# Altium schematic sheet 01 MCU.SchDoc
size A3
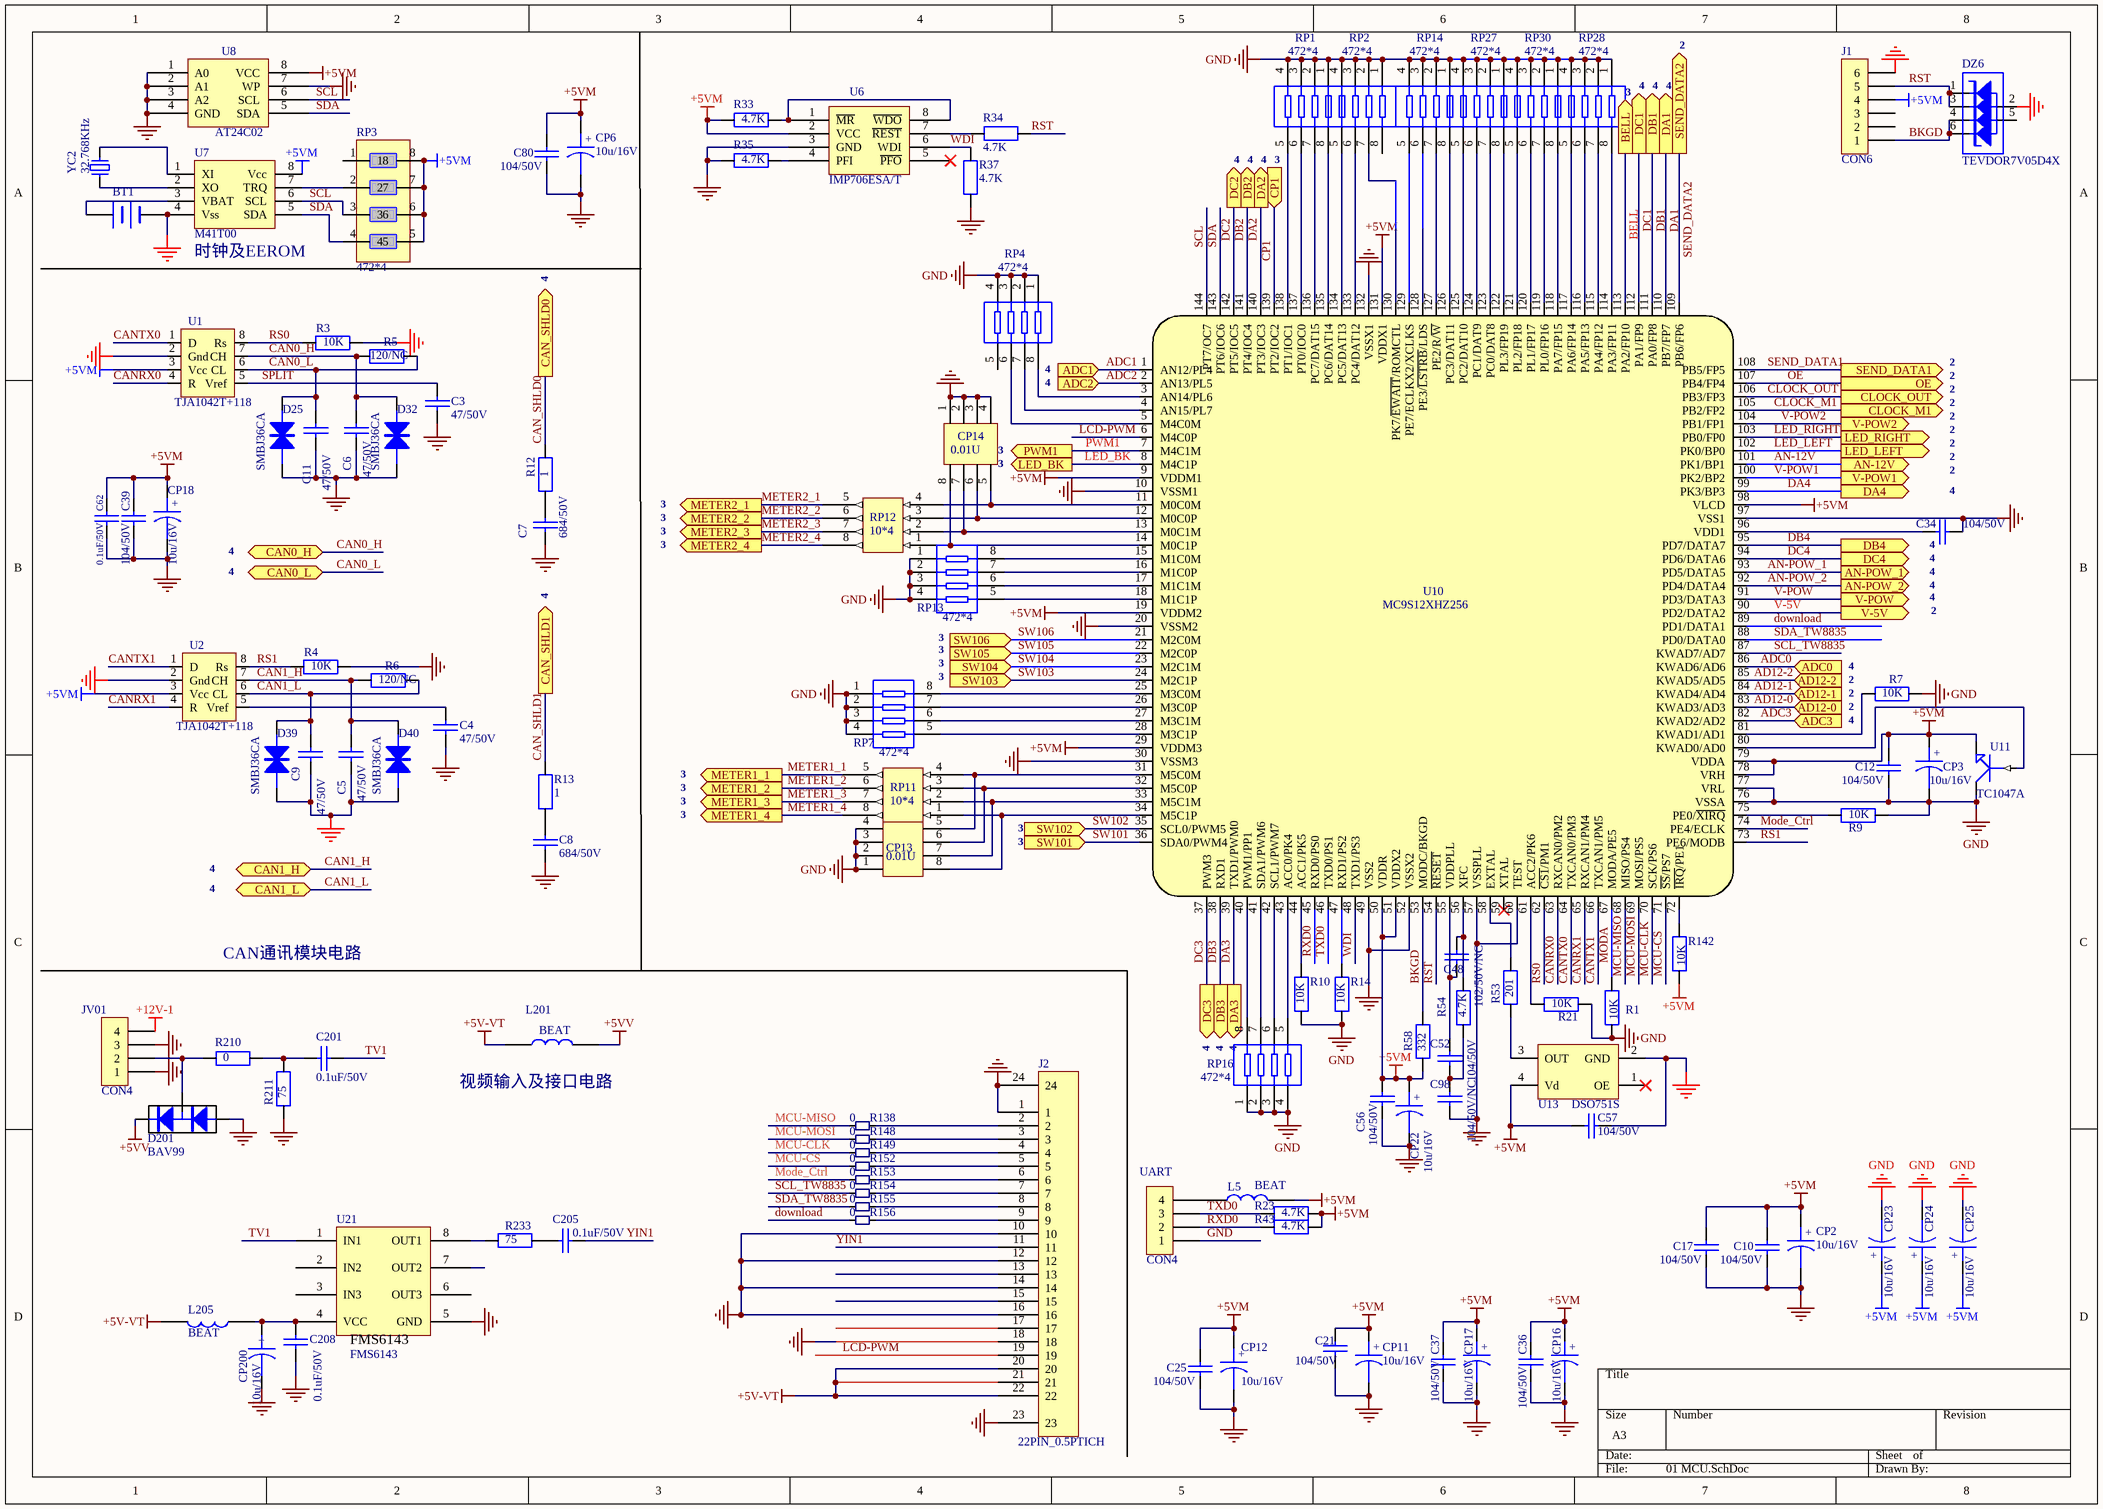
[diagram p0: 01 MCU.SchDoc]

## Parts
BT1  (no value)  [Battery 3]
C3  47/50V  [CR0805]
C4  47/50V  [CR0805]
C5  47/50V  [CR0805]
C6  47/50V  [CR0805]
C7  684/50V  [CR1206]
C8  684/50V  [CR1206]
C9  47/50V  [CR0805]
C10  104/50V  [CR0805]
C11  47/50V  [CR0805]
C12  104/50V  [CR0805]
C17  104/50V  [CR0805]
C21  104/50V  [CR0805]
C25  104/50V  [CR0805]
C34  104/50V  [CR0805]
C36  104/50V  [CR0805]
C37  104/50V  [CR0805]
C39  104/50V  [CR0805]
C48  102/50V/NC  [CR0805]
C52  104/50V  [CR0805]
C56  104/50V  [CR0805]
C57  104/50V  [CR0805]
C62  0.1uF/50V  [CR0805]
C80  104/50V  [CR0805]
C98  104/50V/NC  [CR0805]
C201  0.1uF/50V  [CR0805]
C205  0.1uF/50V  [CR0805]
C208  0.1uF/50V  [CR0805]
CP2  10u/16V  [CE1206]
CP3  10u/16V  [CE1206]
CP6  10u/16V  [CE1206]
CP11  10u/16V  [CE1206]
CP12  10u/16V  [CE1206]
CP13  0.01U  [C4]
CP14  0.01U  [C4]
CP16  10u/16V  [CE1206]
CP17  10u/16V  [CE1206]
CP18  10u/16V  [CE1206]
CP22  10u/16V  [CE1206]
CP23  10u/16V  [CE1206]
CP24  10u/16V  [CE1206]
CP25  10u/16V  [CE1206]
CP200  10u/16V  [CE1206]
D25  SMBJ36CA  [SMB-D]
D32  SMBJ36CA  [SMB-D]
D39  SMBJ36CA  [SMB-D]
D40  SMBJ36CA  [SMB-D]
D201  BAV99  [SOT23]
DZ6  TEVDOR7V05D4X  [SOT-457]
J1  CON6  [DIP 2X3 2.54mm]
J2  22PIN_0.5PTICH  [FPC-22P]
JV01  CON4  [DIP 1X4 2.5mm]
L5  BEAT  [CR0805]
L201  BEAT  [CR0805]
L205  BEAT  [CR0805]
R1  10K  [cr0805]
R3  10K  [CR0805]
R4  10K  [CR0805]
R5  120/NC  [CR0805]
R6  120/NC  [CR0805]
R7  10K  [cr0805]
R9  10K  [CR0805]
R10  10K  [cr0805]
R12  1  [CR0805]
R13  1  [CR0805]
R14  10K  [cr0805]
R21  10K  [cr0805]
R23  4.7K  [CR0805]
R33  4.7K  [CR0805]
R34  4.7K  [CR0805]
R35  4.7K  [CR0805]
R37  4.7K  [CR0805]
R43  4.7K  [CR0805]
R53  201  [CR0805]
R54  4.7K  [CR0805]
R58  332  [CR0805]
R138  0  [CR0805]
R142  10K  [cr0805]
R148  0  [CR0805]
R149  0  [CR0805]
R152  0  [CR0805]
R153  0  [CR0805]
R154  0  [CR0805]
R155  0  [CR0805]
R156  0  [CR0805]
R210  0  [CR0805]
R211  75  [CR0805]
R233  75  [CR0805]
RP1  472*4  [R4]
RP2  472*4  [R4]
RP3  472*4  [R4]
RP4  472*4  [R4]
RP7  472*4  [R4]
RP11  10*4  [R4]
RP12  10*4  [R4]
RP13  472*4  [R4]
RP14  472*4  [R4]
RP16  472*4  [R4]
RP27  472*4  [R4]
RP28  472*4  [R4]
RP30  472*4  [R4]
U1  TJA1042T+118  [SO-8]
U2  TJA1042T+118  [SO-8]
U6  IMP706ESA/T  [SO-8]
U7  M41T00  [SO-8]
U8  AT24C02  [SO-8]
U10  MC9S12XHZ256  [LQFP-144]
U11  TC1047A  [SOT23]
U13  DSO751S  [SMD-CYC]
U21  FMS6143  [SO-8]
UART  CON4  [DIP 1X4 2.5mm]
YC2  32.768KHz  [SM CYC NX3215SA]

## Ports
AD12-0 (in), AD12-1 (in), AD12-2 (in), ADC0 (in), ADC1 (in), ADC2 (in), ADC3 (in), AN-12V (out), AN-POW_1 (out), AN-POW_2 (out), BELL (out), CAN0_H (bidir), CAN0_L (bidir), CAN1_H (bidir), CAN1_L (bidir), CAN_SHLD0 (out), CAN_SHLD1 (out), CLOCK_M1 (out), CLOCK_OUT (out), CP1 (in), DA1 (out), DA2 (out), DA3 (out), DA4 (out), DB1 (out), DB2 (out), DB3 (out), DB4 (out), DC1 (out), DC2 (out), DC3 (out), DC4 (out), LED_BK (out), LED_LEFT (out), LED_RIGHT (out), METER1_1 (out), METER1_2 (out), METER1_3 (out), METER1_4 (out), METER2_1 (out), METER2_2 (out), METER2_3 (out), METER2_4 (out), OE (out), PWM1 (out), SEND_DATA1 (out), SEND_DATA2 (out), SW101 (in), SW102 (in), SW103 (in), SW104 (in), SW105 (in), SW106 (in), V-5V (out), V-POW1 (out), V-POW2 (out), V-POW (out)

## Nets
+5V-VT: J2.20 J2.21 J2.22 L201.1 L205.1
+5VM: C10.1 C12.1 C17.1 C21.2 C25.1 C36.1 C37.1 C39.2 C56.1 C57.1 C62.1 C80.1 CP2.1 CP3.1 CP6.1 CP11.1 CP12.1 CP16.1 CP17.1 CP18.1 CP22.1 CP23.1 CP24.1 CP25.1 J1.4 L5.2 R23.2 R33.2 R43.2 R58.1 R142.2 RP3.5 RP3.6 RP3.7 RP3.8 U1.3(Vcc) U2.3(Vcc) U6.2(VCC) U7.8(Vcc) U8.8(VCC) U10.9(VDDM1) U10.19(VDDM2) U10.29(VDDM3) U10.50(VDDR) U10.51(VDDX2) U10.78(VRH) U10.79(VDDA) U10.98(VLCD) U10.131(VDDX1) U11.1(E) U13.4(Vd)
+5VV: D201.2 L201.2
+12V-1: JV01.4
GND: BT1.2(-) C3.2 C4.2 C5.1 C6.1 C7.2 C8.2 C9.1 C10.2 C11.1 C12.2 C17.2 C21.1 C25.2 C34.2 C36.2 C37.2 C39.1 C56.2 C57.2 C62.2 C80.2 C98.2 C208.2 CP2.2 CP3.2 CP6.2 CP11.2 CP12.2 CP13.1 CP13.2 CP13.3 CP13.4 CP14.1 CP14.2 CP14.3 CP14.4 CP16.2 CP17.2 CP18.2 CP22.2 CP23.2 CP24.2 CP25.2 CP200.2 D25.1 D32.1 D39.1 D40.1 D201.1 DZ6.2 J1.6 J2.1 J2.10 J2.12 J2.14 J2.16 J2.18 J2.23 J2.24 JV01.1 JV01.3 R1.2 R3.2 R4.2 R7.1 R9.2 R10.1 R14.1 R21.2 R35.2 R37.2 R211.2 RP1.1 RP1.2 RP1.3 RP1.4 RP2.1 RP2.2 RP2.3 RP2.4 RP4.1 RP4.2 RP4.3 RP4.4 RP7.1 RP7.2 RP7.3 RP7.4 RP13.1 RP13.2 RP13.3 RP13.4 RP14.1 RP14.2 RP14.3 RP14.4 RP16.1 RP16.2 RP16.3 RP16.4 RP27.1 RP27.2 RP27.3 RP27.4 RP28.1 RP28.2 RP28.3 RP28.4 RP30.1 RP30.2 RP30.3 RP30.4 U1.2(Gnd) U2.2(Gnd) U6.3(GND) U7.4(Vss) U8.1(A0) U8.2(A1) U8.3(A2) U8.4(GND) U8.7(WP) U10.10(VSSM1) U10.20(VSSM2) U10.30(VSSM3) U10.49(VSS2) U10.52(VSSX2) U10.57(VSSPLL) U10.60(TEST) U10.76(VSSA) U10.77(VRL) U10.97(VSS1) U10.132(VSSX1) U11.3(C) U13.2(GND) U21.5(GND) UART.1
AD12-0: U10.83(KWAD3/AD3) ; port AD12-0
AD12-1: U10.84(KWAD4/AD4) ; port AD12-1
AD12-2: U10.85(KWAD5/AD5) ; port AD12-2
ADC0: U10.86(KWAD6/AD6) ; port ADC0
ADC1: U10.1(AN12/PL4) ; port ADC1
ADC2: U10.2(AN13/PL5) ; port ADC2
ADC3: U10.82(KWAD2/AD2) ; port ADC3
AN-12V: U10.101(PK1/BP1) ; port AN-12V
AN-POW_1: U10.93(PD5/DATA5) ; port AN-POW_1
AN-POW_2: U10.92(PD4/DATA4) ; port AN-POW_2
BELL: U10.113(PA2/FP10) ; port BELL
BKGD: DZ6.4 DZ6.6 J1.1 R58.2 U10.53(MODC/BKGD)
CAN0_H: C6.2 D32.2 R5.2 U1.7(CH) ; port CAN0_H
CAN0_L: C11.2 D25.2 R5.1 U1.6(CL) ; port CAN0_L
CAN1_H: C5.2 D40.2 R6.2 U2.7(CH) ; port CAN1_H
CAN1_L: C9.2 D39.2 R6.1 U2.6(CL) ; port CAN1_L
CAN_SHLD0: R12.2 ; port CAN_SHLD0
CAN_SHLD1: R13.2 ; port CAN_SHLD1
CANRX0: U1.4(R) U10.63(RXCAN0/PM2)
CANRX1: U2.4(R) U10.65(RXCAN1/PM4)
CANTX0: U1.1(D) U10.64(TXCAN0/PM3)
CANTX1: U2.1(D) U10.66(TXCAN1/PM5)
CLOCK_M1: U10.105(PB2/FP2) ; port CLOCK_M1
CLOCK_OUT: U10.106(PB3/FP3) ; port CLOCK_OUT
CP1: U10.139(PT2/IOC2) ; port CP1
DA1: U10.110(PB7/FP7) ; port DA1
DA2: U10.140(PT3/IOC3) ; port DA2
DA3: U10.39(TXD1/PWM0) ; port DA3
DA4: U10.99(PK3/BP3) ; port DA4
DB1: U10.111(PA0/FP8) ; port DB1
DB2: U10.141(PT4/IOC4) ; port DB2
DB3: U10.38(RXD1) ; port DB3
DB4: U10.95(PD7/DATA7) ; port DB4
DC1: U10.112(PA1/FP9) ; port DC1
DC2: U10.142(PT5/IOC5) ; port DC2
DC3: U10.37(PWM3) ; port DC3
DC4: U10.94(PD6/DATA6) ; port DC4
download: R156.2 U10.89(PD1/DATA1)
LCD-PWM: J2.19 U10.6(M4C0P)
LED_BK: U10.8(M4C1P) ; port LED_BK
LED_LEFT: U10.102(PK0/BP0) ; port LED_LEFT
LED_RIGHT: U10.103(PB0/FP0) ; port LED_RIGHT
MCU-CLK: R149.2 U10.70(SCK/PS6)
MCU-CS: R152.2 U10.71(~{SS}/PS7)
MCU-MISO: R138.2 U10.68(MISO/PS4)
MCU-MOSI: R148.2 U10.69(MOSI/PS5)
METER1_1: RP11.5 ; port METER1_1
METER1_2: RP11.6 ; port METER1_2
METER1_3: RP11.7 ; port METER1_3
METER1_4: RP11.8 ; port METER1_4
METER2_1: RP12.5 ; port METER2_1
METER2_2: RP12.6 ; port METER2_2
METER2_3: RP12.7 ; port METER2_3
METER2_4: RP12.8 ; port METER2_4
MODA: R1.1 U10.67(MODA/PE5)
Mode_Ctrl: R153.2 U10.74(PE4/ECLK)
OE: U10.107(PB4/FP4) ; port OE
PWM1: U10.7(M4C1M) ; port PWM1
RS0: R3.1 U1.8(Rs) U10.62(~{CS1}/PM1)
RS1: R4.1 U2.8(Rs) U10.73(PE6/MODB)
RST: DZ6.1 DZ6.3 J1.5 R34.2 U10.54(~{RESET})
RXD0: R43.1 U10.45(RXD0/PS0) UART.2
SCL: RP3.3 U7.6(SCL) U8.6(SCL) U10.144(PT7/OC7)
SCL_TW8835: R154.2 U10.87(KWAD7/AD7)
SDA: RP3.4 U7.5(SDA) U8.5(SDA) U10.143(PT6/IOC6)
SDA_TW8835: R155.2 U10.88(PD0/DATA0)
SEND_DATA1: U10.108(PB5/FP5) ; port SEND_DATA1
SEND_DATA2: U10.109(PB6/FP6) ; port SEND_DATA2
SPLIT: C3.1 U1.5(Vref)
SW101: U10.36(SDA0/PWM4) ; port SW101
SW102: U10.35(SCL0/PWM5) ; port SW102
SW103: U10.24(M2C1P) ; port SW103
SW104: U10.23(M2C1M) ; port SW104
SW105: U10.22(M2C0P) ; port SW105
SW106: U10.21(M2C0M) ; port SW106
TV1: C201.2 U21.1(IN1)
TXD0: R23.1 U10.46(TXD0/PS1) UART.3
V-5V: U10.90(PD2/DATA2) ; port V-5V
V-POW: U10.91(PD3/DATA3) ; port V-POW
V-POW1: U10.100(PK2/BP2) ; port V-POW1
V-POW2: U10.104(PB1/FP1) ; port V-POW2
WDI: R37.1 U6.6(WDI) U10.48(TXD1/PS3)
YIN1: C205.2 J2.11
NetBT1_1: BT1.1(+) U7.3(VBAT)
NetC4_1: C4.1 U2.5(Vref)
NetC7_1: C7.1 R12.1
NetC8_1: C8.1 R13.1
NetC34_1: C34.1 U10.96(VDD1)
NetC48_1: C48.1 R54.1 U10.56(XFC)
NetC48_2: C48.2 C52.1 U10.55(VDDPLL)
NetC52_2: C52.2 C98.1 R54.2
NetC201_1: C201.1 R210.2 R211.1
NetC205_1: C205.1 R233.1
NetC208_1: C208.1 CP200.1 L205.2 U21.4(VCC)
NetCP13_5: CP13.5 RP11.4 U10.31(M5C0M)
NetCP13_6: CP13.6 RP11.3 U10.32(M5C0P)
NetCP13_7: CP13.7 RP11.2 U10.33(M5C1M)
NetCP13_8: CP13.8 RP11.1 U10.34(M5C1P)
NetCP14_5: CP14.5 RP12.4 U10.11(M0C0M)
NetCP14_6: CP14.6 RP12.3 U10.12(M0C0P)
NetCP14_7: CP14.7 RP12.2 U10.13(M0C1M)
NetCP14_8: CP14.8 RP12.1 U10.14(M0C1P)
NetD201_3: D201.3 JV01.2 R210.1
NetJ2_2: J2.2 R138.1
NetJ2_3: J2.3 R148.1
NetJ2_4: J2.4 R149.1
NetJ2_5: J2.5 R152.1
NetJ2_6: J2.6 R153.1
NetJ2_7: J2.7 R154.1
NetJ2_8: J2.8 R155.1
NetJ2_9: J2.9 R156.1
NetL5_1: L5.1 UART.4
NetR7_2: R7.2 U10.81(KWAD1/AD1)
NetR9_1: R9.1 U10.75(PE0/~{XIRQ})
NetR10_2: R10.2 U10.44(ACC1/PK5)
NetR14_2: R14.2 U10.47(RXD1/PS2)
NetR21_1: R21.1 U10.61(ACC2/PK6)
NetR33_1: R33.1 U6.1(~{MR}) U6.8(~{WDO})
NetR34_1: R34.1 U6.7(~{REST})
NetR35_1: R35.1 U6.4(PFI)
NetR53_1: R53.1 U13.3(OUT)
NetR53_2: R53.2 U10.58(EXTAL)
NetR142_1: R142.1 U10.72(~{IRQ}/PE1)
NetR233_2: R233.2 U21.8(OUT1)
NetRP1_5: RP1.5 U10.138(PT1/IOC1)
NetRP1_6: RP1.6 U10.137(PT0/IOC0)
NetRP1_7: RP1.7 U10.136(PC7/DAT15)
NetRP1_8: RP1.8 U10.135(PC6/DAT14)
NetRP2_5: RP2.5 U10.134(PC5/DAT13)
NetRP2_6: RP2.6 U10.133(PC4/DAT12)
NetRP2_7: RP2.7 U10.130(PK7/~{EWAIT}/ROMCTL)
NetRP3_2: RP3.2 U7.7(TRQ)
NetRP4_6: RP4.6 U10.5(M4C0M)
NetRP4_7: RP4.7 U10.4(AN15/PL7)
NetRP4_8: RP4.8 U10.3(AN14/PL6)
NetRP7_5: RP7.5 U10.28(M3C1P)
NetRP7_6: RP7.6 U10.27(M3C1M)
NetRP7_7: RP7.7 U10.26(M3C0P)
NetRP7_8: RP7.8 U10.25(M3C0M)
NetRP13_5: RP13.5 U10.18(M1C1P)
NetRP13_6: RP13.6 U10.17(M1C1M)
NetRP13_7: RP13.7 U10.16(M1C0P)
NetRP13_8: RP13.8 U10.15(M1C0M)
NetRP14_5: RP14.5 U10.129(PE7/ECLKX2/XCLKS)
NetRP14_6: RP14.6 U10.128(PE3/~{LSTRB}/LDS)
NetRP14_7: RP14.7 U10.127(PE2/R/~{W})
NetRP14_8: RP14.8 U10.126(PC3/DAT11)
NetRP16_5: RP16.5 U10.43(ACC0/PK4)
NetRP16_6: RP16.6 U10.42(SCL1/PWM7)
NetRP16_7: RP16.7 U10.41(SDA1/PWM6)
NetRP16_8: RP16.8 U10.40(PWM1/PP1)
NetRP27_5: RP27.5 U10.125(PC2/DAT10)
NetRP27_6: RP27.6 U10.124(PC1/DAT9)
NetRP27_7: RP27.7 U10.123(PC0/DAT8)
NetRP27_8: RP27.8 U10.122(PL3/FP19)
NetRP28_5: RP28.5 U10.117(PA6/FP14)
NetRP28_6: RP28.6 U10.116(PA5/FP13)
NetRP28_7: RP28.7 U10.115(PA4/FP12)
NetRP28_8: RP28.8 U10.114(PA3/FP11)
NetRP30_5: RP30.5 U10.121(PL2/FP18)
NetRP30_6: RP30.6 U10.120(PL1/FP17)
NetRP30_7: RP30.7 U10.119(PL0/FP16)
NetRP30_8: RP30.8 U10.118(PA7/FP15)
NetU7_1: U7.1(XI) YC2.2
NetU7_2: U7.2(XO) YC2.1
NetU10_80: U10.80(KWAD0/AD0) U11.2(B)

Not connected (* = marked no-connect by the designer): DZ6 5; J1 2 3; J2 13 15 17; RP2 8; RP3 1; RP4 5; U6 5(~{PFO})*; U10 59(XTAL)*; U13 1(OE)*; U21 2(IN2) 3(IN3) 6(OUT3) 7(OUT2)

## Notes on the sheet
- 2
- (near RP28) 3
- (near RP28) 4
- 4
- (near RP1) 4
- (near RP1) 3
- (near U7) 时钟及EEROM
- (near RP4) 4
- (near CP14) 3
- 3
- (near C34) 4
- (near RP7) 3
- (near R7) 2
- (near R7) 4
- CAN通讯模块电路
- (near RP16) 4
- (near L201) 视频输入及接口电路
- (in symbol CAPACITOR POL) +

## Library data of the parts
BT1 = BATTERY
C3-C12 C17 C21 C25 C34 C36 C37 C39 C48 C52 C56 C57 C62 C80 C98 C208 = CAP: Capacitor
C201 C205 = CAP: 贴片电容
CP2 CP3 CP6 CP11 CP12 CP16-CP18 CP22-CP25 CP200 = CAPACITOR POL: Capacitor
CP13 CP14 = RC_ARRAY
D25 D32 D39 D40 = TVS
D201 = BAV23S: 双二极管
DZ6 = BZA456G: 二极管排
J1 = CON6: Connector
JV01 UART = CON4: Connector
R1 R3-R7 R9 R10 R12-R14 R21 R23 R33-R35 R37 R43 R53 R54 R58 R142 R210 R211 R233 = RES: 贴片电阻
R138 R148 R149 R152-R156 = Resister mini: 贴片电阻
RP1 RP2 RP4 RP7 RP13 RP14 RP16 RP27 RP28 RP30 = R_LINE4: 贴片排阻
RP3 = R_ARRAY
RP11 RP12 = R_PAI
U1 U2 = SN65HVD251
U6 = IMP706
U7 = M41T00: IC
U8 = AT24C02: IC
U11 = DTC143
U13 = POW_CRY
U21 = FMS6143: IC-视频滤波
YC2 = CRYSTAL0